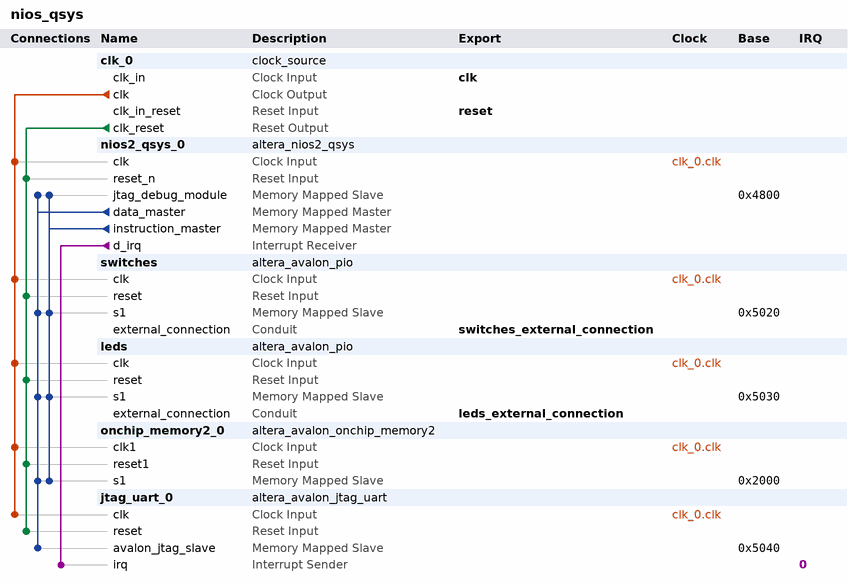
[diagram p0: system contents]
# Platform Designer (Qsys) system nios_qsys
# Parameters at their usual value, and those the tool derives, are not listed.
package require -exact qsys 11.0
create_system nios_qsys
set_project_property DEVICE_FAMILY CYCLONEII

add_instance clk_0 clock_source 11.0
set_instance_parameter_value clk_0 clockFrequency 50000000

add_instance nios2_qsys_0 altera_nios2_qsys 11.0
set_instance_parameter_value nios2_qsys_0 manuallyAssignCpuID false
set_instance_parameter_value nios2_qsys_0 resetSlave onchip_memory2_0.s1
set_instance_parameter_value nios2_qsys_0 exceptionSlave onchip_memory2_0.s1
set_instance_parameter_value nios2_qsys_0 breakSlave nios2_qsys_0.jtag_debug_module
set_instance_parameter_value nios2_qsys_0 impl Tiny
set_instance_parameter_value nios2_qsys_0 icache_size 4096

add_instance switches altera_avalon_pio 11.0
set_instance_parameter_value switches direction Input
set_instance_parameter_value switches width 18

add_instance leds altera_avalon_pio 11.0
set_instance_parameter_value leds direction Output
set_instance_parameter_value leds width 18

add_instance onchip_memory2_0 altera_avalon_onchip_memory2 11.0
set_instance_parameter_value onchip_memory2_0 dataWidth 32
set_instance_parameter_value onchip_memory2_0 dualPort false
set_instance_parameter_value onchip_memory2_0 initMemContent true
set_instance_parameter_value onchip_memory2_0 initializationFileName onchip_memory2_0
set_instance_parameter_value onchip_memory2_0 memorySize 8192

add_instance jtag_uart_0 altera_avalon_jtag_uart 11.0
set_instance_parameter_value jtag_uart_0 simInteractiveOptions INTERACTIVE_ASCII_OUTPUT

# connections
add_connection clk_0.clk jtag_uart_0.clk clock
add_connection clk_0.clk leds.clk clock
add_connection clk_0.clk nios2_qsys_0.clk clock
add_connection clk_0.clk onchip_memory2_0.clk1 clock
add_connection clk_0.clk switches.clk clock
add_connection clk_0.clk_reset jtag_uart_0.reset reset
add_connection clk_0.clk_reset leds.reset reset
add_connection clk_0.clk_reset nios2_qsys_0.reset_n reset
add_connection clk_0.clk_reset onchip_memory2_0.reset1 reset
add_connection clk_0.clk_reset switches.reset reset
add_connection nios2_qsys_0.data_master jtag_uart_0.avalon_jtag_slave avalon
set_connection_parameter_value nios2_qsys_0.data_master/jtag_uart_0.avalon_jtag_slave baseAddress 0x5040
add_connection nios2_qsys_0.data_master leds.s1 avalon
set_connection_parameter_value nios2_qsys_0.data_master/leds.s1 baseAddress 0x5030
add_connection nios2_qsys_0.data_master nios2_qsys_0.jtag_debug_module avalon
set_connection_parameter_value nios2_qsys_0.data_master/nios2_qsys_0.jtag_debug_module baseAddress 0x4800
add_connection nios2_qsys_0.data_master onchip_memory2_0.s1 avalon
set_connection_parameter_value nios2_qsys_0.data_master/onchip_memory2_0.s1 baseAddress 0x2000
add_connection nios2_qsys_0.data_master switches.s1 avalon
set_connection_parameter_value nios2_qsys_0.data_master/switches.s1 baseAddress 0x5020
add_connection nios2_qsys_0.instruction_master leds.s1 avalon
set_connection_parameter_value nios2_qsys_0.instruction_master/leds.s1 baseAddress 0x5030
add_connection nios2_qsys_0.instruction_master nios2_qsys_0.jtag_debug_module avalon
set_connection_parameter_value nios2_qsys_0.instruction_master/nios2_qsys_0.jtag_debug_module baseAddress 0x4800
add_connection nios2_qsys_0.instruction_master onchip_memory2_0.s1 avalon
set_connection_parameter_value nios2_qsys_0.instruction_master/onchip_memory2_0.s1 baseAddress 0x2000
add_connection nios2_qsys_0.instruction_master switches.s1 avalon
set_connection_parameter_value nios2_qsys_0.instruction_master/switches.s1 baseAddress 0x5020
add_connection nios2_qsys_0.d_irq jtag_uart_0.irq interrupt
set_connection_parameter_value nios2_qsys_0.d_irq/jtag_uart_0.irq irqNumber 0

# exported interfaces
add_interface clk clock sink
set_interface_property clk EXPORT_OF clk_0.clk_in
add_interface switches_external_connection conduit end
set_interface_property switches_external_connection EXPORT_OF switches.external_connection
add_interface leds_external_connection conduit end
set_interface_property leds_external_connection EXPORT_OF leds.external_connection
add_interface reset reset sink
set_interface_property reset EXPORT_OF clk_0.clk_in_reset

save_system nios_qsys.qsys
